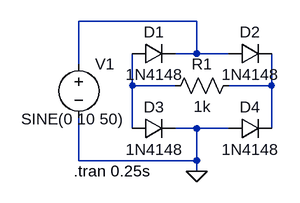
[diagram p0: schematic rectifier_1_2.asc]
rectifier_1_2.asc, the LTspice schematic file:
Version 4
SHEET 1 880 680
WIRE 176 80 0 80
WIRE 176 128 176 80
WIRE 176 128 144 128
WIRE 224 128 176 128
WIRE 0 144 0 80
WIRE 80 176 80 128
WIRE 144 176 80 176
WIRE 288 176 288 128
WIRE 288 176 224 176
WIRE 80 240 80 176
WIRE 176 240 144 240
WIRE 224 240 176 240
WIRE 288 240 288 176
WIRE 0 288 0 224
WIRE 176 288 176 240
WIRE 176 288 0 288
WIRE 176 304 176 288
FLAG 176 304 0
SYMBOL voltage 0 128 R0
WINDOW 3 -86 98 Left 2
WINDOW 123 0 0 Left 0
WINDOW 39 0 0 Left 0
SYMATTR InstName V1
SYMATTR Value SINE(0 10 50)
SYMBOL diode 80 144 R270
WINDOW 0 32 32 VTop 2
WINDOW 3 0 32 VBottom 2
SYMATTR InstName D1
SYMATTR Value 1N4148
SYMBOL diode 224 144 R270
WINDOW 0 32 32 VTop 2
WINDOW 3 0 32 VBottom 2
SYMATTR InstName D2
SYMATTR Value 1N4148
SYMBOL diode 80 256 R270
WINDOW 0 32 32 VTop 2
WINDOW 3 0 32 VBottom 2
SYMATTR InstName D3
SYMATTR Value 1N4148
SYMBOL diode 224 256 R270
WINDOW 0 32 32 VTop 2
WINDOW 3 0 32 VBottom 2
SYMATTR InstName D4
SYMATTR Value 1N4148
SYMBOL res 240 160 R90
WINDOW 0 0 56 VBottom 2
WINDOW 3 32 56 VTop 2
SYMATTR InstName R1
SYMATTR Value 1k
TEXT -8 304 Left 2 !.tran 0.25s

The netlist it stands for:
* rectifier_1_2.asc
V1 N001 0 SINE(0 10 50)
D1 N002 N001 1N4148
D2 N001 N003 1N4148
D3 N002 0 1N4148
D4 0 N003 1N4148
R1 N003 N002 1k
.model D D
.lib standard.dio
.tran 0.25s
.backanno
.end